# EAGLE design Freedom Proto v1 (EAGLE 9.6.2)
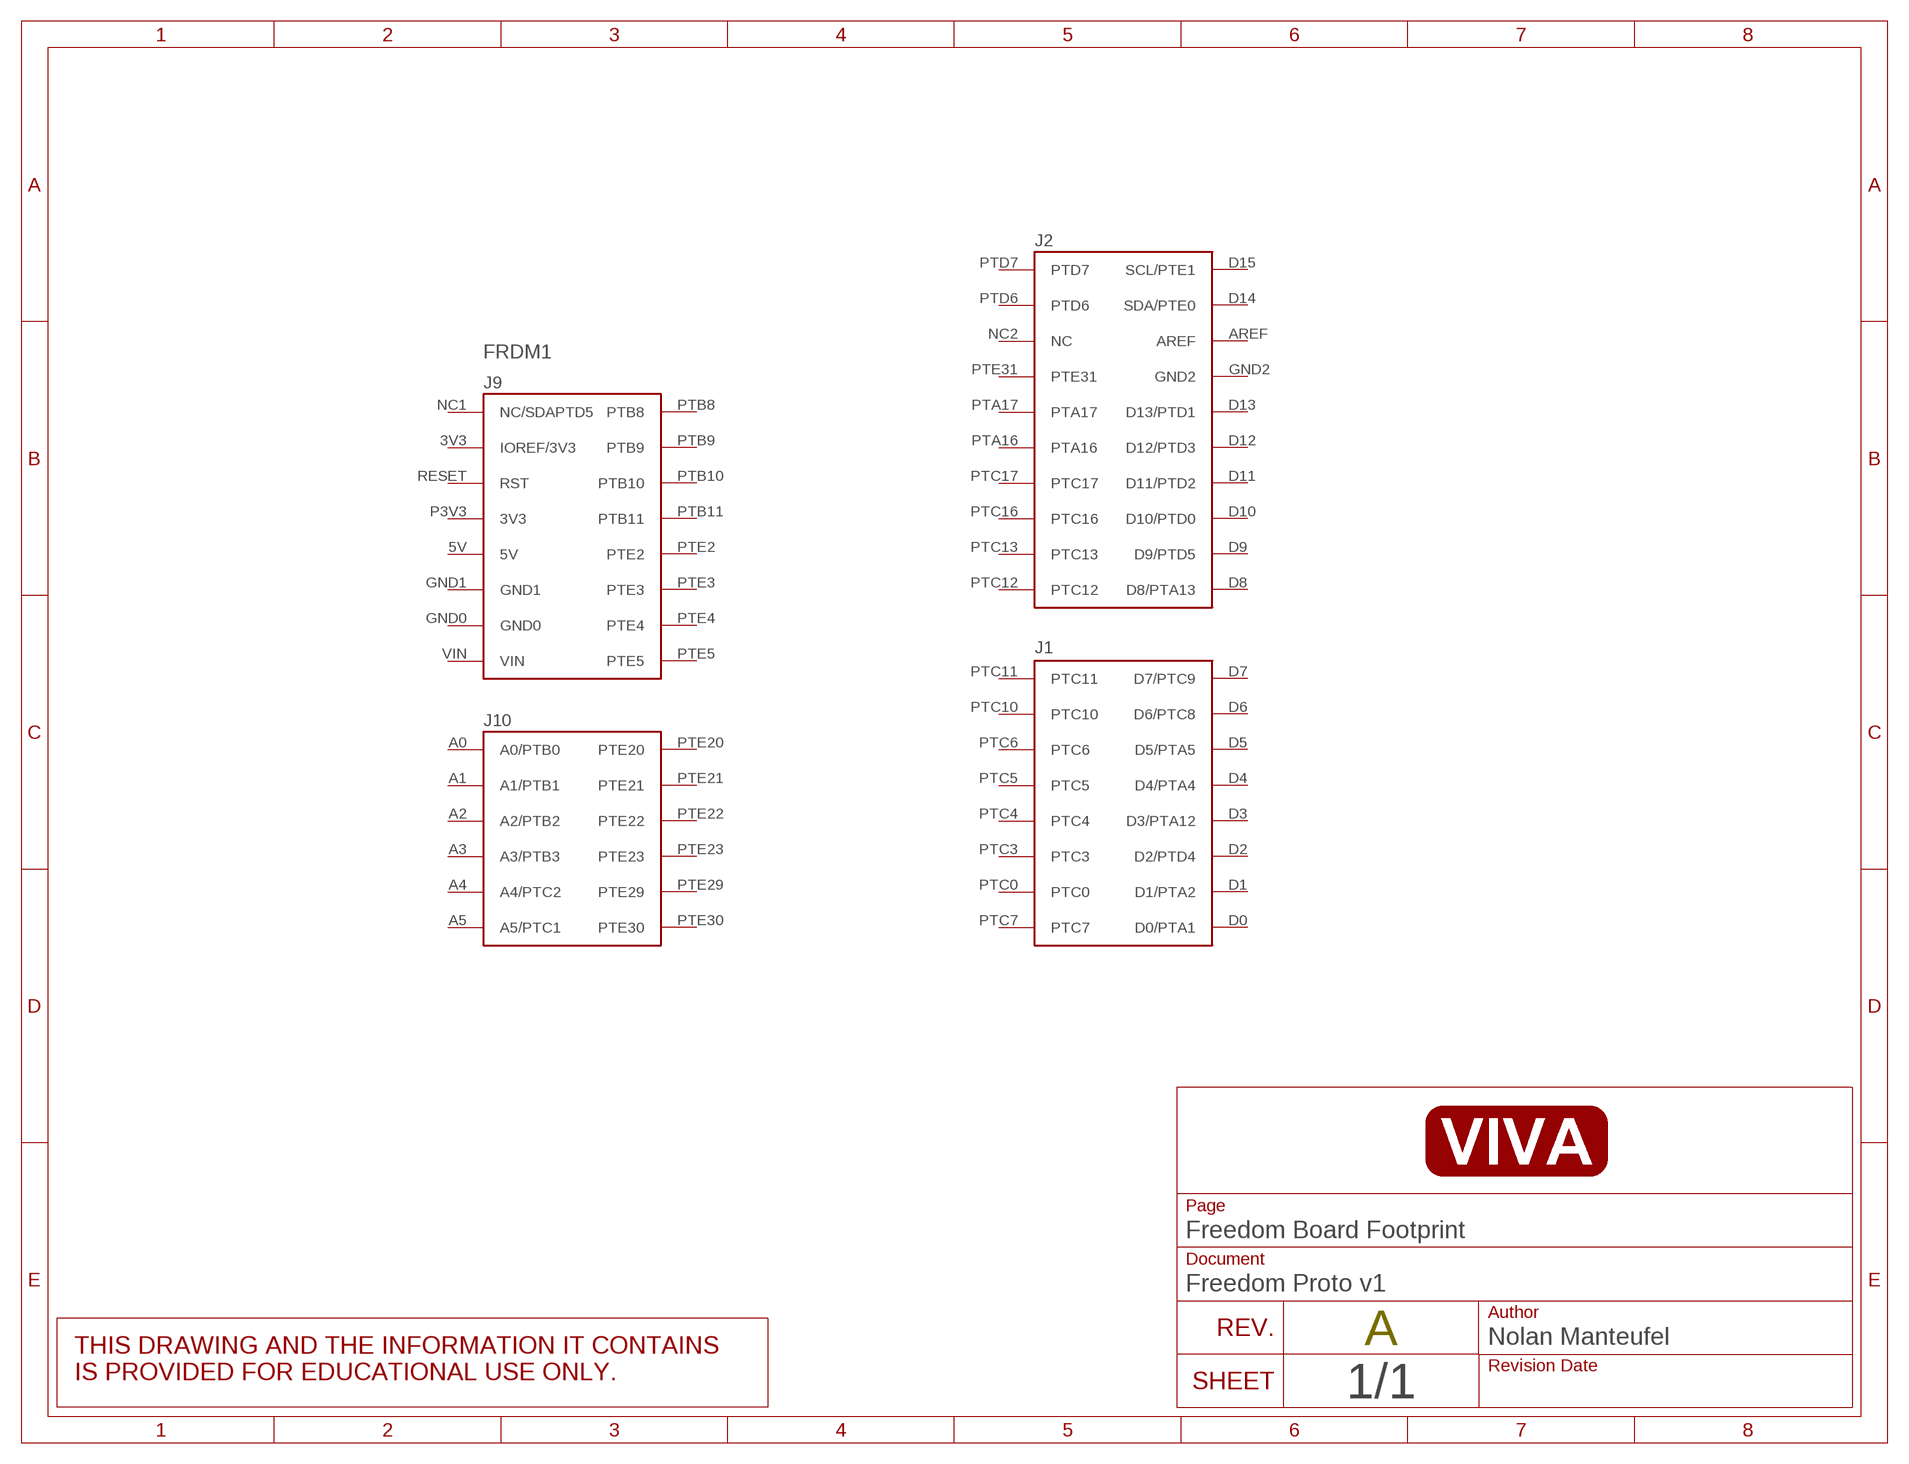
[diagram p0: schematic, sheet 1]

## Parts
FRDM1  FRDM-KL25ZNORMAL  [FRDM_KL25Z_NORMAL]
Unconnected: FRDM1.3V3(IOREF/3V3) FRDM1.5V FRDM1.A0(A0/PTB0) FRDM1.A1(A1/PTB1) FRDM1.A2(A2/PTB2) FRDM1.A3(A3/PTB3) FRDM1.A4(A4/PTC2) FRDM1.A5(A5/PTC1) FRDM1.AREF FRDM1.D0(D0/PTA1) FRDM1.D1(D1/PTA2) FRDM1.D2(D2/PTD4) FRDM1.D3(D3/PTA12) FRDM1.D4(D4/PTA4) FRDM1.D5(D5/PTA5) FRDM1.D6(D6/PTC8) FRDM1.D7(D7/PTC9) FRDM1.D8(D8/PTA13) FRDM1.D9(D9/PTD5) FRDM1.D10(D10/PTD0) FRDM1.D11(D11/PTD2) FRDM1.D12(D12/PTD3) FRDM1.D13(D13/PTD1) FRDM1.D14(SDA/PTE0) FRDM1.D15(SCL/PTE1) FRDM1.GND0 FRDM1.GND1 FRDM1.GND2 FRDM1.NC1(NC/SDAPTD5) FRDM1.NC2(NC) FRDM1.P3V3(3V3) FRDM1.PTA16 FRDM1.PTA17 FRDM1.PTB8 FRDM1.PTB9 FRDM1.PTB10 FRDM1.PTB11 FRDM1.PTC0 FRDM1.PTC3 FRDM1.PTC4 FRDM1.PTC5 FRDM1.PTC6 FRDM1.PTC7 FRDM1.PTC10 FRDM1.PTC11 FRDM1.PTC12 FRDM1.PTC13 FRDM1.PTC16 FRDM1.PTC17 FRDM1.PTD6 FRDM1.PTD7 FRDM1.PTE2 FRDM1.PTE3 FRDM1.PTE4 FRDM1.PTE5 FRDM1.PTE20 FRDM1.PTE21 FRDM1.PTE22 FRDM1.PTE23 FRDM1.PTE29 FRDM1.PTE30 FRDM1.PTE31 FRDM1.RESET(RST) FRDM1.VIN

## Library data of the parts
FRDM1 = nolan-utsa:FRDM-KL25Z: For creating FRDM-KL25Z shields

## Board
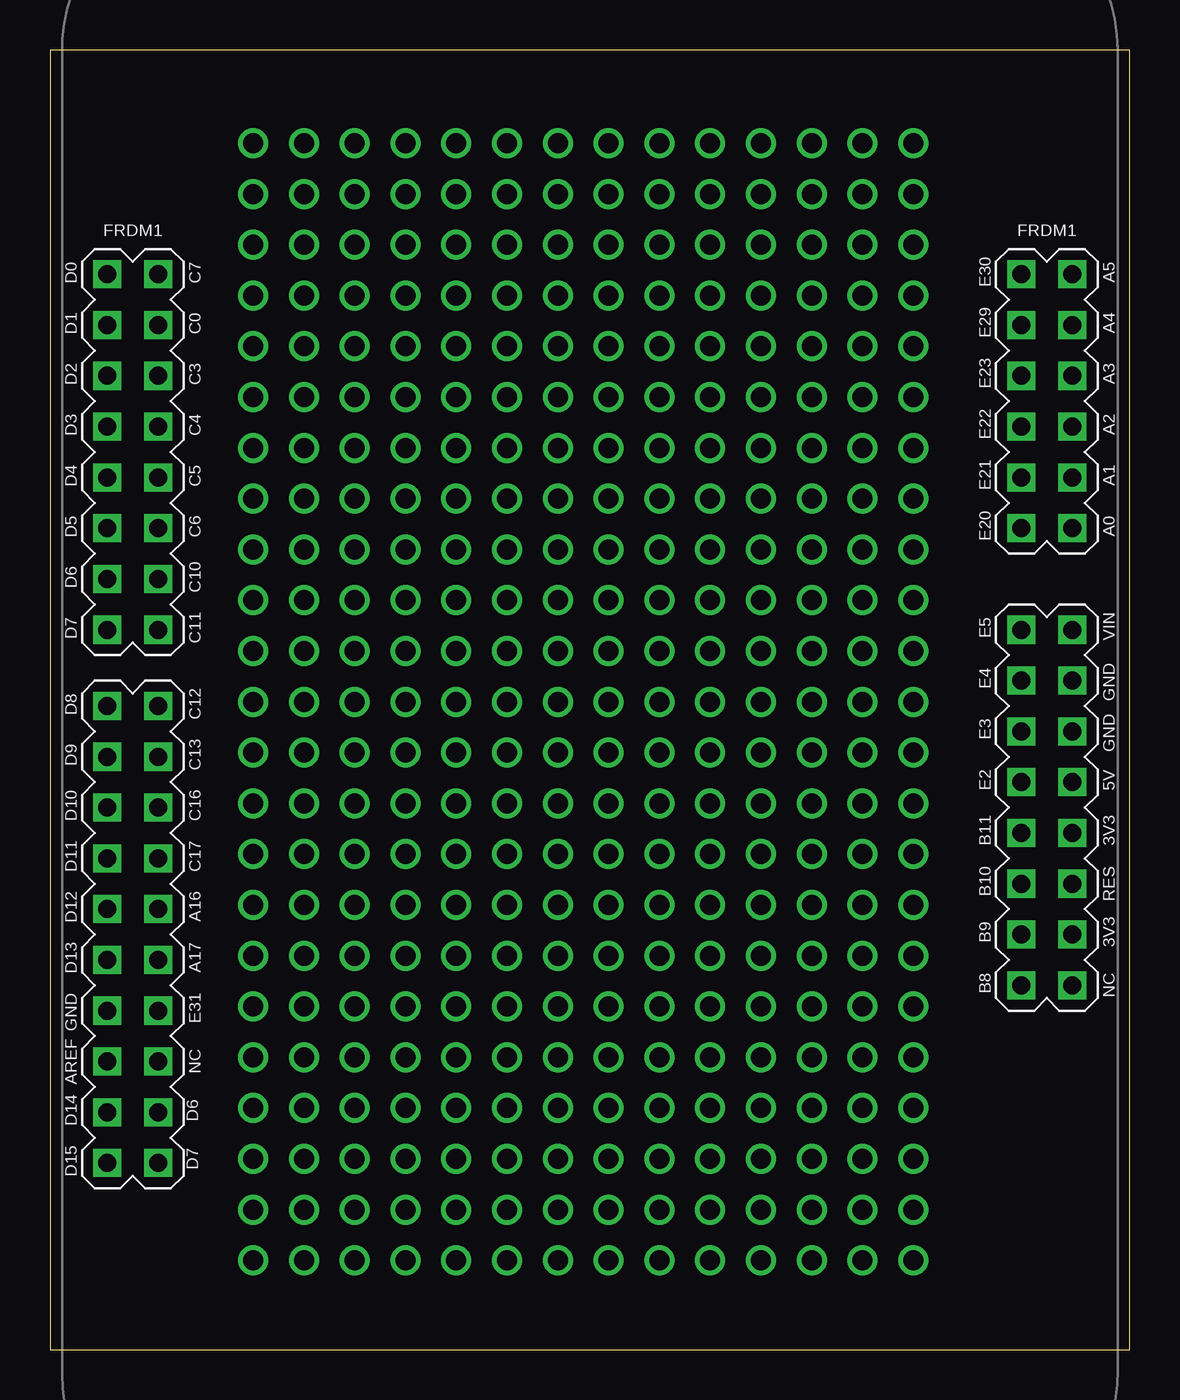
[diagram p1: board, top side]

Size 54 x 65 mm. Coordinates in mm from the lower left corner, seen from the top.
Outline: 0,0 54,0 54,65 0,65 0,0
Copper layers (1*16): Top 0.035mm / dielectric 1.5mm / Bottom 0.035mm
Design rules "default": minimum track width 6mil, minimum drill 0.35mm, track to track 6mil, track to pad 6mil, pad to pad 6mil, via to via 6mil, smd to smd 6mil, copper to edge 40mil, drill to drill 6mil, minimum pad ring 10mil, minimum via ring 8mil, stop-mask expansion 4mil, vias tented up to drill 0mil, thermal gap 10mil

### Footprints (pad centres in the part's own frame; a part is rotated, then mirrored left to right if it is on the bottom)
FRDM_KL25Z_NORMAL = drill 0.9 square: 3V3 24.13,-15.24; 5V 24.13,-7.62; A0 24.13,5.08; A1 24.13,7.62; A2 24.13,10.16; A3 24.13,12.7; A4 24.13,15.24; A5 24.13,17.78; AREF -24.13,-21.59; D0 -24.13,17.78; D1 -24.13,15.24; D2 -24.13,12.7; D3 -24.13,10.16; D4 -24.13,7.62; D5 -24.13,5.08; D6 -24.13,2.54; D7 -24.13,0; D8 -24.13,-3.81; D9 -24.13,-6.35; D10 -24.13,-8.89; D11 -24.13,-11.43; D12 -24.13,-13.97; D13 -24.13,-16.51; D14 -24.13,-24.13; D15 -24.13,-26.67; GND0 24.13,-2.54; GND1 24.13,-5.08; GND2 -24.13,-19.05; NC1 24.13,-17.78; NC2 -21.59,-21.59; P3V3 24.13,-10.16; PTA16 -21.59,-13.97; PTA17 -21.59,-16.51; PTB8 21.59,-17.78; PTB9 21.59,-15.24; PTB10 21.59,-12.7; PTB11 21.59,-10.16; PTC0 -21.59,15.24; PTC3 -21.59,12.7; PTC4 -21.59,10.16; PTC5 -21.59,7.62; PTC6 -21.59,5.08; PTC7 -21.59,17.78; PTC10 -21.59,2.54; PTC11 -21.59,0; PTC12 -21.59,-3.81; PTC13 -21.59,-6.35; PTC16 -21.59,-8.89; PTC17 -21.59,-11.43; PTD6 -21.59,-24.13; PTD7 -21.59,-26.67; PTE2 21.59,-7.62; PTE3 21.59,-5.08; PTE4 21.59,-2.54; PTE5 21.59,0; PTE20 21.59,5.08; PTE21 21.59,7.62; PTE22 21.59,10.16; PTE23 21.59,12.7; PTE29 21.59,15.24; PTE30 21.59,17.78; PTE31 -21.59,-19.05; RESET 24.13,-12.7; VIN 24.13,0

### Placement (x,y rotation side)
FRDM1  27,36 0 top

### Tracks (layer width: path | path; a pad name or v marks a point on that pad's centre or on a via)
N$1  (via drill 1)
  other vias: 10.16,9.54
N$2  (via drill 1)
  other vias: 10.16,12.08
N$3  (via drill 1)
  other vias: 12.7,12.08
N$4  (via drill 1)
  other vias: 12.7,9.54
N$5  (via drill 1)
  other vias: 15.24,9.54
N$6  (via drill 1)
  other vias: 15.24,12.08
N$7  (via drill 1)
  other vias: 17.78,12.08
N$8  (via drill 1)
  other vias: 17.78,9.54
N$9  (via drill 1)
  other vias: 20.32,9.54
N$10  (via drill 1)
  other vias: 20.32,12.08
N$11  (via drill 1)
  other vias: 22.86,12.08
N$12  (via drill 1)
  other vias: 22.86,9.54
N$13  (via drill 1)
  other vias: 25.4,12.08
N$14  (via drill 1)
  other vias: 25.4,9.54
N$15  (via drill 1)
  other vias: 27.94,12.08
N$16  (via drill 1)
  other vias: 27.94,9.54
N$17  (via drill 1)
  other vias: 30.48,12.08
N$18  (via drill 1)
  other vias: 30.48,9.54
N$19  (via drill 1)
  other vias: 33.02,12.08
N$20  (via drill 1)
  other vias: 33.02,9.54
N$21  (via drill 1)
  other vias: 35.56,12.08
N$22  (via drill 1)
  other vias: 35.56,9.54
N$23  (via drill 1)
  other vias: 38.1,12.08
N$24  (via drill 1)
  other vias: 38.1,9.54
N$25  (via drill 1)
  other vias: 40.64,12.08
N$26  (via drill 1)
  other vias: 40.64,9.54
N$27  (via drill 1)
  other vias: 43.18,12.08
N$28  (via drill 1)
  other vias: 43.18,9.54
N$29  (via drill 1)
  other vias: 10.16,14.62
N$30  (via drill 1)
  other vias: 10.16,17.16
N$31  (via drill 1)
  other vias: 12.7,17.16
N$32  (via drill 1)
  other vias: 12.7,14.62
N$33  (via drill 1)
  other vias: 15.24,14.62
N$34  (via drill 1)
  other vias: 15.24,17.16
N$35  (via drill 1)
  other vias: 17.78,17.16
N$36  (via drill 1)
  other vias: 17.78,14.62
N$37  (via drill 1)
  other vias: 20.32,14.62
N$38  (via drill 1)
  other vias: 20.32,17.16
N$39  (via drill 1)
  other vias: 22.86,17.16
N$40  (via drill 1)
  other vias: 22.86,14.62
N$41  (via drill 1)
  other vias: 25.4,17.16
N$42  (via drill 1)
  other vias: 25.4,14.62
N$43  (via drill 1)
  other vias: 27.94,17.16
N$44  (via drill 1)
  other vias: 27.94,14.62
N$45  (via drill 1)
  other vias: 30.48,17.16
N$46  (via drill 1)
  other vias: 30.48,14.62
N$47  (via drill 1)
  other vias: 33.02,17.16
N$48  (via drill 1)
  other vias: 33.02,14.62
N$49  (via drill 1)
  other vias: 35.56,17.16
N$50  (via drill 1)
  other vias: 35.56,14.62
N$51  (via drill 1)
  other vias: 38.1,17.16
N$52  (via drill 1)
  other vias: 38.1,14.62
N$53  (via drill 1)
  other vias: 40.64,17.16
N$54  (via drill 1)
  other vias: 40.64,14.62
N$55  (via drill 1)
  other vias: 43.18,17.16
N$56  (via drill 1)
  other vias: 43.18,14.62
N$57  (via drill 1)
  other vias: 10.16,19.7
N$58  (via drill 1)
  other vias: 10.16,22.24
N$59  (via drill 1)
  other vias: 12.7,22.24
N$60  (via drill 1)
  other vias: 12.7,19.7
N$61  (via drill 1)
  other vias: 15.24,19.7
N$62  (via drill 1)
  other vias: 15.24,22.24
N$63  (via drill 1)
  other vias: 17.78,22.24
N$64  (via drill 1)
  other vias: 17.78,19.7
N$65  (via drill 1)
  other vias: 20.32,19.7
N$66  (via drill 1)
  other vias: 20.32,22.24
N$67  (via drill 1)
  other vias: 22.86,22.24
N$68  (via drill 1)
  other vias: 22.86,19.7
N$69  (via drill 1)
  other vias: 25.4,22.24
N$70  (via drill 1)
  other vias: 25.4,19.7
N$71  (via drill 1)
  other vias: 27.94,22.24
N$72  (via drill 1)
  other vias: 27.94,19.7
N$73  (via drill 1)
  other vias: 30.48,22.24
N$74  (via drill 1)
  other vias: 30.48,19.7
N$75  (via drill 1)
  other vias: 33.02,22.24
N$76  (via drill 1)
  other vias: 33.02,19.7
N$77  (via drill 1)
  other vias: 35.56,22.24
N$78  (via drill 1)
  other vias: 35.56,19.7
N$79  (via drill 1)
  other vias: 38.1,22.24
N$80  (via drill 1)
  other vias: 38.1,19.7
N$81  (via drill 1)
  other vias: 40.64,22.24
N$82  (via drill 1)
  other vias: 40.64,19.7
N$83  (via drill 1)
  other vias: 43.18,22.24
N$84  (via drill 1)
  other vias: 43.18,19.7
N$85  (via drill 1)
  other vias: 10.16,24.78
N$86  (via drill 1)
  other vias: 10.16,27.32
N$87  (via drill 1)
  other vias: 12.7,27.32
N$88  (via drill 1)
  other vias: 12.7,24.78
N$89  (via drill 1)
  other vias: 15.24,24.78
N$90  (via drill 1)
  other vias: 15.24,27.32
N$91  (via drill 1)
  other vias: 17.78,27.32
N$92  (via drill 1)
  other vias: 17.78,24.78
N$93  (via drill 1)
  other vias: 20.32,24.78
N$94  (via drill 1)
  other vias: 20.32,27.32
N$95  (via drill 1)
  other vias: 22.86,27.32
N$96  (via drill 1)
  other vias: 22.86,24.78
N$97  (via drill 1)
  other vias: 25.4,27.32
N$98  (via drill 1)
  other vias: 25.4,24.78
N$99  (via drill 1)
  other vias: 27.94,27.32
N$100  (via drill 1)
  other vias: 27.94,24.78
N$101  (via drill 1)
  other vias: 30.48,27.32
N$102  (via drill 1)
  other vias: 30.48,24.78
N$103  (via drill 1)
  other vias: 33.02,27.32
N$104  (via drill 1)
  other vias: 33.02,24.78
N$105  (via drill 1)
  other vias: 35.56,27.32
N$106  (via drill 1)
  other vias: 35.56,24.78
N$107  (via drill 1)
  other vias: 38.1,27.32
N$108  (via drill 1)
  other vias: 38.1,24.78
N$109  (via drill 1)
  other vias: 40.64,27.32
N$110  (via drill 1)
  other vias: 40.64,24.78
N$111  (via drill 1)
  other vias: 43.18,27.32
N$112  (via drill 1)
  other vias: 43.18,24.78
N$113  (via drill 1)
  other vias: 10.16,29.86
N$114  (via drill 1)
  other vias: 10.16,32.4
N$115  (via drill 1)
  other vias: 12.7,32.4
N$116  (via drill 1)
  other vias: 12.7,29.86
N$117  (via drill 1)
  other vias: 15.24,29.86
N$118  (via drill 1)
  other vias: 15.24,32.4
N$119  (via drill 1)
  other vias: 17.78,32.4
N$120  (via drill 1)
  other vias: 17.78,29.86
N$121  (via drill 1)
  other vias: 20.32,29.86
N$122  (via drill 1)
  other vias: 20.32,32.4
N$123  (via drill 1)
  other vias: 22.86,32.4
N$124  (via drill 1)
  other vias: 22.86,29.86
N$125  (via drill 1)
  other vias: 25.4,32.4
N$126  (via drill 1)
  other vias: 25.4,29.86
N$127  (via drill 1)
  other vias: 27.94,32.4
N$128  (via drill 1)
  other vias: 27.94,29.86
N$129  (via drill 1)
  other vias: 30.48,32.4
N$130  (via drill 1)
  other vias: 30.48,29.86
N$131  (via drill 1)
  other vias: 33.02,32.4
N$132  (via drill 1)
  other vias: 33.02,29.86
N$133  (via drill 1)
  other vias: 35.56,32.4
N$134  (via drill 1)
  other vias: 35.56,29.86
N$135  (via drill 1)
  other vias: 38.1,32.4
N$136  (via drill 1)
  other vias: 38.1,29.86
N$137  (via drill 1)
  other vias: 40.64,32.4
N$138  (via drill 1)
  other vias: 40.64,29.86
N$139  (via drill 1)
  other vias: 43.18,32.4
N$140  (via drill 1)
  other vias: 43.18,29.86
N$141  (via drill 1)
  other vias: 10.16,34.94
N$142  (via drill 1)
  other vias: 10.16,37.48
N$143  (via drill 1)
  other vias: 12.7,37.48
N$144  (via drill 1)
  other vias: 12.7,34.94
N$145  (via drill 1)
  other vias: 15.24,34.94
N$146  (via drill 1)
  other vias: 15.24,37.48
N$147  (via drill 1)
  other vias: 17.78,37.48
N$148  (via drill 1)
  other vias: 17.78,34.94
N$149  (via drill 1)
  other vias: 20.32,34.94
N$150  (via drill 1)
  other vias: 20.32,37.48
N$151  (via drill 1)
  other vias: 22.86,37.48
N$152  (via drill 1)
  other vias: 22.86,34.94
N$153  (via drill 1)
  other vias: 25.4,37.48
N$154  (via drill 1)
  other vias: 25.4,34.94
N$155  (via drill 1)
  other vias: 27.94,37.48
N$156  (via drill 1)
  other vias: 27.94,34.94
N$157  (via drill 1)
  other vias: 30.48,37.48
N$158  (via drill 1)
  other vias: 30.48,34.94
N$159  (via drill 1)
  other vias: 33.02,37.48
N$160  (via drill 1)
  other vias: 33.02,34.94
N$161  (via drill 1)
  other vias: 35.56,37.48
N$162  (via drill 1)
  other vias: 35.56,34.94
N$163  (via drill 1)
  other vias: 38.1,37.48
N$164  (via drill 1)
  other vias: 38.1,34.94
N$165  (via drill 1)
  other vias: 40.64,37.48
N$166  (via drill 1)
  other vias: 40.64,34.94
N$167  (via drill 1)
  other vias: 43.18,37.48
N$168  (via drill 1)
  other vias: 43.18,34.94
N$169  (via drill 1)
  other vias: 10.16,40.02
N$170  (via drill 1)
  other vias: 10.16,42.56
N$171  (via drill 1)
  other vias: 12.7,42.56
N$172  (via drill 1)
  other vias: 12.7,40.02
N$173  (via drill 1)
  other vias: 15.24,40.02
N$174  (via drill 1)
  other vias: 15.24,42.56
N$175  (via drill 1)
  other vias: 17.78,42.56
N$176  (via drill 1)
  other vias: 17.78,40.02
N$177  (via drill 1)
  other vias: 20.32,40.02
N$178  (via drill 1)
  other vias: 20.32,42.56
N$179  (via drill 1)
  other vias: 22.86,42.56
N$180  (via drill 1)
  other vias: 22.86,40.02
N$181  (via drill 1)
  other vias: 25.4,42.56
N$182  (via drill 1)
  other vias: 25.4,40.02
N$183  (via drill 1)
  other vias: 27.94,42.56
N$184  (via drill 1)
  other vias: 27.94,40.02
N$185  (via drill 1)
  other vias: 30.48,42.56
N$186  (via drill 1)
  other vias: 30.48,40.02
N$187  (via drill 1)
  other vias: 33.02,42.56
N$188  (via drill 1)
  other vias: 33.02,40.02
N$189  (via drill 1)
  other vias: 35.56,42.56
N$190  (via drill 1)
  other vias: 35.56,40.02
N$191  (via drill 1)
  other vias: 38.1,42.56
N$192  (via drill 1)
  other vias: 38.1,40.02
N$193  (via drill 1)
  other vias: 40.64,42.56
N$194  (via drill 1)
  other vias: 40.64,40.02
N$195  (via drill 1)
  other vias: 43.18,42.56
N$196  (via drill 1)
  other vias: 43.18,40.02
N$197  (via drill 1)
  other vias: 10.16,45.1
N$198  (via drill 1)
  other vias: 10.16,47.64
N$199  (via drill 1)
  other vias: 12.7,47.64
N$200  (via drill 1)
  other vias: 12.7,45.1
N$201  (via drill 1)
  other vias: 15.24,45.1
N$202  (via drill 1)
  other vias: 15.24,47.64
N$203  (via drill 1)
  other vias: 17.78,47.64
N$204  (via drill 1)
  other vias: 17.78,45.1
N$205  (via drill 1)
  other vias: 20.32,45.1
N$206  (via drill 1)
  other vias: 20.32,47.64
N$207  (via drill 1)
  other vias: 22.86,47.64
N$208  (via drill 1)
  other vias: 22.86,45.1
N$209  (via drill 1)
  other vias: 25.4,47.64
N$210  (via drill 1)
  other vias: 25.4,45.1
N$211  (via drill 1)
  other vias: 27.94,47.64
N$212  (via drill 1)
  other vias: 27.94,45.1
N$213  (via drill 1)
  other vias: 30.48,47.64
N$214  (via drill 1)
  other vias: 30.48,45.1
N$215  (via drill 1)
  other vias: 33.02,47.64
N$216  (via drill 1)
  other vias: 33.02,45.1
N$217  (via drill 1)
  other vias: 35.56,47.64
N$218  (via drill 1)
  other vias: 35.56,45.1
N$219  (via drill 1)
  other vias: 38.1,47.64
N$220  (via drill 1)
  other vias: 38.1,45.1
N$221  (via drill 1)
  other vias: 40.64,47.64
N$222  (via drill 1)
  other vias: 40.64,45.1
N$223  (via drill 1)
  other vias: 43.18,47.64
N$224  (via drill 1)
  other vias: 43.18,45.1
N$225  (via drill 1)
  other vias: 10.16,50.18
N$226  (via drill 1)
  other vias: 12.7,50.18
N$227  (via drill 1)
  other vias: 15.24,50.18
N$228  (via drill 1)
  other vias: 17.78,50.18
N$229  (via drill 1)
  other vias: 20.32,50.18
N$230  (via drill 1)
  other vias: 22.86,50.18
N$231  (via drill 1)
  other vias: 25.4,50.18
N$232  (via drill 1)
  other vias: 27.94,50.18
N$233  (via drill 1)
  other vias: 30.48,50.18
N$234  (via drill 1)
  other vias: 33.02,50.18
N$235  (via drill 1)
  other vias: 35.56,50.18
N$236  (via drill 1)
  other vias: 38.1,50.18
N$237  (via drill 1)
  other vias: 40.64,50.18
N$238  (via drill 1)
  other vias: 43.18,50.18
N$239  (via drill 1)
  other vias: 10.16,52.72
N$240  (via drill 1)
  other vias: 10.16,55.26
N$241  (via drill 1)
  other vias: 12.7,55.26
N$242  (via drill 1)
  other vias: 12.7,52.72
N$243  (via drill 1)
  other vias: 15.24,52.72
N$244  (via drill 1)
  other vias: 15.24,55.26
N$245  (via drill 1)
  other vias: 17.78,55.26
N$246  (via drill 1)
  other vias: 17.78,52.72
N$247  (via drill 1)
  other vias: 20.32,52.72
N$248  (via drill 1)
  other vias: 20.32,55.26
N$249  (via drill 1)
  other vias: 22.86,55.26
N$250  (via drill 1)
  other vias: 22.86,52.72
N$251  (via drill 1)
  other vias: 25.4,55.26
N$252  (via drill 1)
  other vias: 25.4,52.72
N$253  (via drill 1)
  other vias: 27.94,55.26
N$254  (via drill 1)
  other vias: 27.94,52.72
N$255  (via drill 1)
  other vias: 30.48,55.26
N$256  (via drill 1)
  other vias: 30.48,52.72
N$257  (via drill 1)
  other vias: 33.02,55.26
N$258  (via drill 1)
  other vias: 33.02,52.72
N$259  (via drill 1)
  other vias: 35.56,55.26
N$260  (via drill 1)
  other vias: 35.56,52.72
N$261  (via drill 1)
  other vias: 38.1,55.26
N$262  (via drill 1)
  other vias: 38.1,52.72
N$263  (via drill 1)
  other vias: 40.64,55.26
N$264  (via drill 1)
  other vias: 40.64,52.72
N$265  (via drill 1)
  other vias: 43.18,55.26
N$266  (via drill 1)
  other vias: 43.18,52.72
N$267  (via drill 1)
  other vias: 10.16,57.8
N$268  (via drill 1)
  other vias: 10.16,60.34
N$269  (via drill 1)
  other vias: 12.7,60.34
N$270  (via drill 1)
  other vias: 12.7,57.8
N$271  (via drill 1)
  other vias: 15.24,57.8
N$272  (via drill 1)
  other vias: 15.24,60.34
N$273  (via drill 1)
  other vias: 17.78,60.34
N$274  (via drill 1)
  other vias: 17.78,57.8
N$275  (via drill 1)
  other vias: 20.32,57.8
N$276  (via drill 1)
  other vias: 20.32,60.34
N$277  (via drill 1)
  other vias: 22.86,60.34
N$278  (via drill 1)
  other vias: 22.86,57.8
N$279  (via drill 1)
  other vias: 25.4,60.34
N$280  (via drill 1)
  other vias: 25.4,57.8
N$281  (via drill 1)
  other vias: 27.94,60.34
N$282  (via drill 1)
  other vias: 27.94,57.8
N$283  (via drill 1)
  other vias: 30.48,60.34
N$284  (via drill 1)
  other vias: 30.48,57.8
N$285  (via drill 1)
  other vias: 33.02,60.34
N$286  (via drill 1)
  other vias: 33.02,57.8
N$287  (via drill 1)
  other vias: 35.56,60.34
N$288  (via drill 1)
  other vias: 35.56,57.8
N$289  (via drill 1)
  other vias: 38.1,60.34
N$290  (via drill 1)
  other vias: 38.1,57.8
N$291  (via drill 1)
  other vias: 40.64,60.34
N$292  (via drill 1)
  other vias: 40.64,57.8
N$293  (via drill 1)
  other vias: 43.18,60.34
N$294  (via drill 1)
  other vias: 43.18,57.8
N$296  (via drill 1)
  other vias: 10.16,4.46
N$297  (via drill 1)
  other vias: 12.7,4.46
N$300  (via drill 1)
  other vias: 15.24,4.46
N$301  (via drill 1)
  other vias: 17.78,4.46
N$304  (via drill 1)
  other vias: 20.32,4.46
N$305  (via drill 1)
  other vias: 22.86,4.46
N$307  (via drill 1)
  other vias: 25.4,4.46
N$309  (via drill 1)
  other vias: 27.94,4.46
N$311  (via drill 1)
  other vias: 30.48,4.46
N$313  (via drill 1)
  other vias: 33.02,4.46
N$315  (via drill 1)
  other vias: 35.56,4.46
N$317  (via drill 1)
  other vias: 38.1,4.46
N$319  (via drill 1)
  other vias: 40.64,4.46
N$321  (via drill 1)
  other vias: 43.18,4.46
N$323  (via drill 1)
  other vias: 10.16,7
N$324  (via drill 1)
  other vias: 12.7,7
N$325  (via drill 1)
  other vias: 15.24,7
N$326  (via drill 1)
  other vias: 17.78,7
N$327  (via drill 1)
  other vias: 20.32,7
N$328  (via drill 1)
  other vias: 22.86,7
N$329  (via drill 1)
  other vias: 25.4,7
N$330  (via drill 1)
  other vias: 27.94,7
N$331  (via drill 1)
  other vias: 30.48,7
N$332  (via drill 1)
  other vias: 33.02,7
N$333  (via drill 1)
  other vias: 35.56,7
N$334  (via drill 1)
  other vias: 38.1,7
N$335  (via drill 1)
  other vias: 40.64,7
N$336  (via drill 1)
  other vias: 43.18,7